# EAGLE design wt12_breakout_board_v11 (EAGLE 5.11)
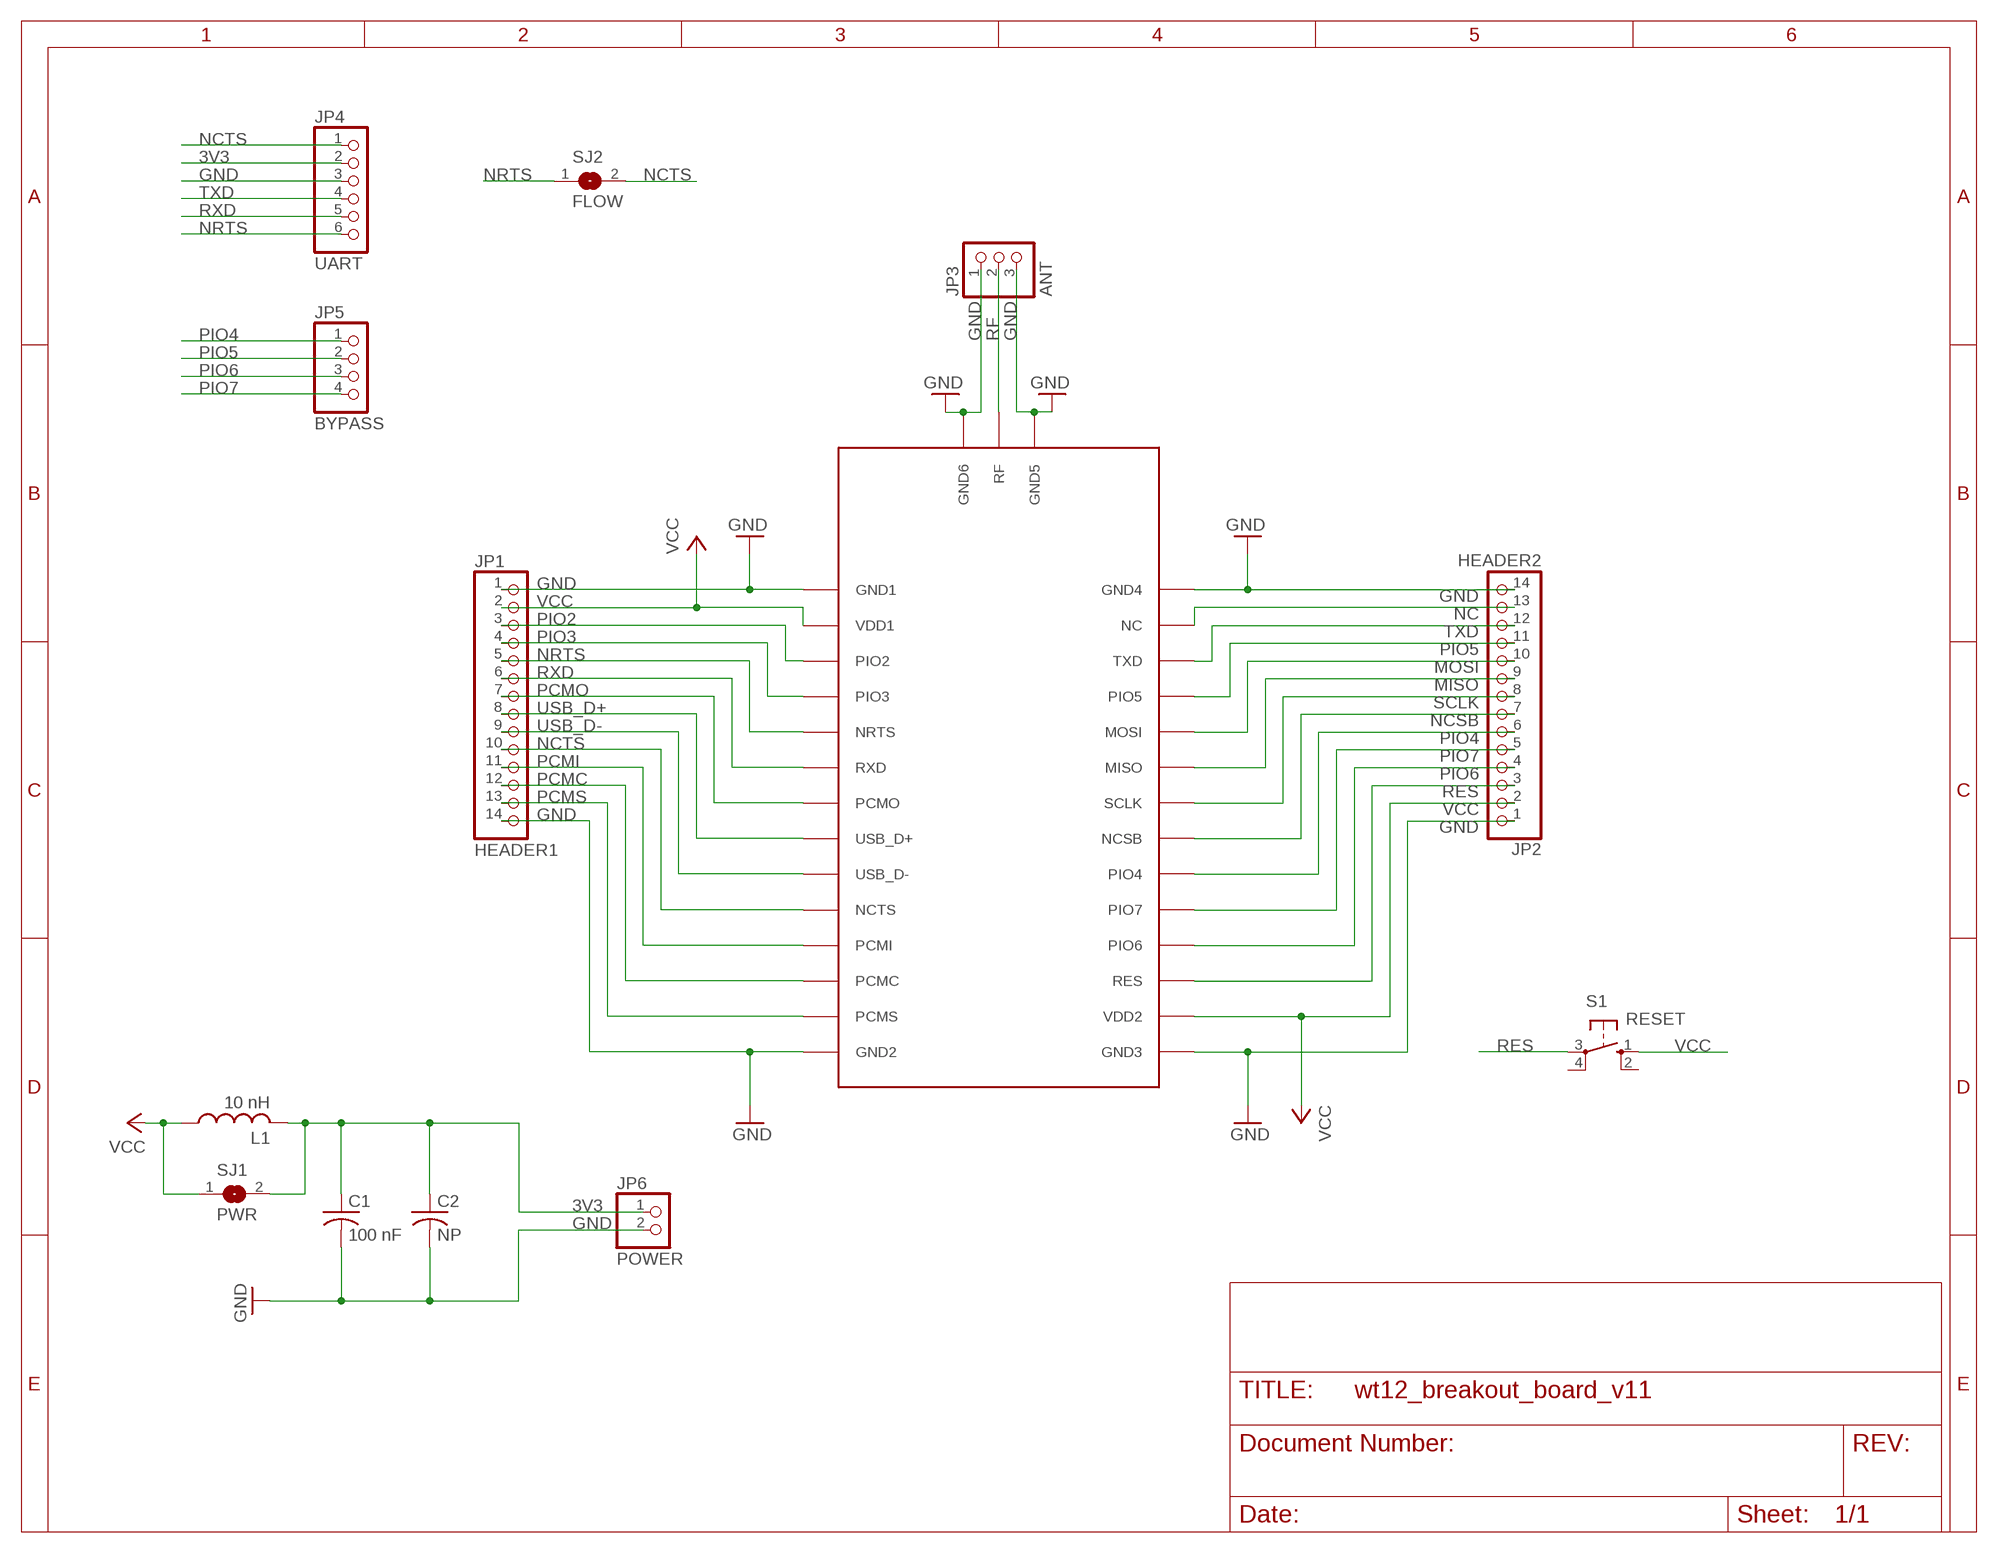
[diagram p0: schematic, sheet 1]

## Parts
C1  100 nF  C-US025-025X050  [C025-025X050]
C2  NP  C-US025-025X050  [C025-025X050]
JP1  HEADER1  PINHD-1X14  [1X14]
JP2  HEADER2  PINHD-1X14  [1X14]
JP3  ANT  PINHD-1X3  [1X03]
JP4  UART  PINHD-1X6  [1X06]
JP5  BYPASS  PINHD-1X4  [1X04]
JP6  POWER  PINHD-1X2  [1X02]
L1  10 nH  L-US0204/7  [0204/7]
S1  RESET  10-XX  [B3F-10XX]
SJ1  PWR  SJ  [SJ]
SJ2  FLOW  SJ  [SJ]
U1  WT12  [WT12]

## Nets
3V3: C1.1 C2.1 JP4.2 JP6.1 L1.2 SJ1.2
GND: C1.2 C2.2 JP1.1 JP1.14 JP2.1 JP2.14 JP3.1 JP3.3 JP4.3 JP6.2 U1.GND1 U1.GND2 U1.GND3 U1.GND4 U1.GND5 U1.GND6
MISO: JP2.9 U1.MISO
MOSI: JP2.10 U1.MOSI
NC: JP2.13 U1.NC
NCSB: JP2.7 U1.NCSB
NCTS: JP1.10 JP4.1 SJ2.2 U1.NCTS
NRTS: JP1.5 JP4.6 SJ2.1 U1.NRTS
PCMC: JP1.12 U1.PCMC
PCMI: JP1.11 U1.PCMI
PCMO: JP1.7 U1.PCMO
PCMS: JP1.13 U1.PCMS
PIO2: JP1.3 U1.PIO2
PIO3: JP1.4 U1.PIO3
PIO4: JP2.6 JP5.1 U1.PIO4
PIO5: JP2.11 JP5.2 U1.PIO5
PIO6: JP2.4 JP5.3 U1.PIO6
PIO7: JP2.5 JP5.4 U1.PIO7
RES: JP2.3 S1.3(P) U1.RES
RF: JP3.2 U1.RF
RXD: JP1.6 JP4.5 U1.RXD
SCLK: JP2.8 U1.SCLK
TXD: JP2.12 JP4.4 U1.TXD
USB_D+: JP1.8 U1.USB_D+
USB_D-: JP1.9 U1.USB_D-
VCC: JP1.2 JP2.2 L1.1 S1.1(S) SJ1.1 U1.VDD1 U1.VDD2
Unconnected: S1.2(S1) S1.4(P1)

## Library data of the parts
C1 C2 = resistor:C-US: CAPACITOR, American symbol
JP1 JP2 = pinhead:PINHD-1X14: PIN HEADER
JP3 = pinhead:PINHD-1X3: PIN HEADER
JP4 = pinhead:PINHD-1X6: PIN HEADER
JP5 = pinhead:PINHD-1X4: PIN HEADER
JP6 = pinhead:PINHD-1X2: PIN HEADER
L1 = resistor:L-US: INDUCTOR, American symbol
S1 = switch-omron:10-XX: OMRON SWITCH; MPN: B3F-1000; OC_FARNELL: 176432; OC_NEWARK: 36M3542
SJ1 SJ2 = jumper:SJ: SMD solder JUMPER
U1 = wt12:WT12: WT12 is a class 2, Bluetooth 2.1 + EDR module. It's a highly integrated Bluetooth module, containing all the necessary elements from Bluetooth radio to antenna, and a fully implemented iWRAP protocol stack. Key Features: - Bluetooth class 2 - Integrated chip antenna - Enhanced Data Rates (EDR) with data throughput up to 2-3Mbps - Support for Adaptive Frequency Hopping (AFH) and 802.11 co-existence - USB version 2.0, UART with bypass mode, GPIO and PCM interfaces - 8MB flash memory - Size: 26 x 14 x 2,4mm - Simple iWRAP firmware for controlling Bluetooth wireless technology - Industrial temperature range from -40C to +85C - Based on CSR BC04 chipset - RoHS compliant - Up to 14 supported Bluetooth profiles in iWRAP firmware - Support for on-board applications - Fully qualified end product with Bluetooth 2.1 + EDR, CE, FCC and IC Bluegiga WT12 provides an ideal solution for developers that want to integrate Bluetooth wireless technology to their design with limited knowledge of Bluetooth and RF technologies. By using WT12 combined with Bluegiga's complete development, testing and verification service offering, and excellent developer support, OEMs and designers ensure that their products reach the market rapidly and cost-effectively in relation to time and resources. Bluegiga has in-house knowledge of both software and hardware - offering customers a single point of contact for all Bluetooth related issues.

## Net classes
0 default: width 0.254 mm, drill 0.508 mm, clearance 0.254 mm

## Board
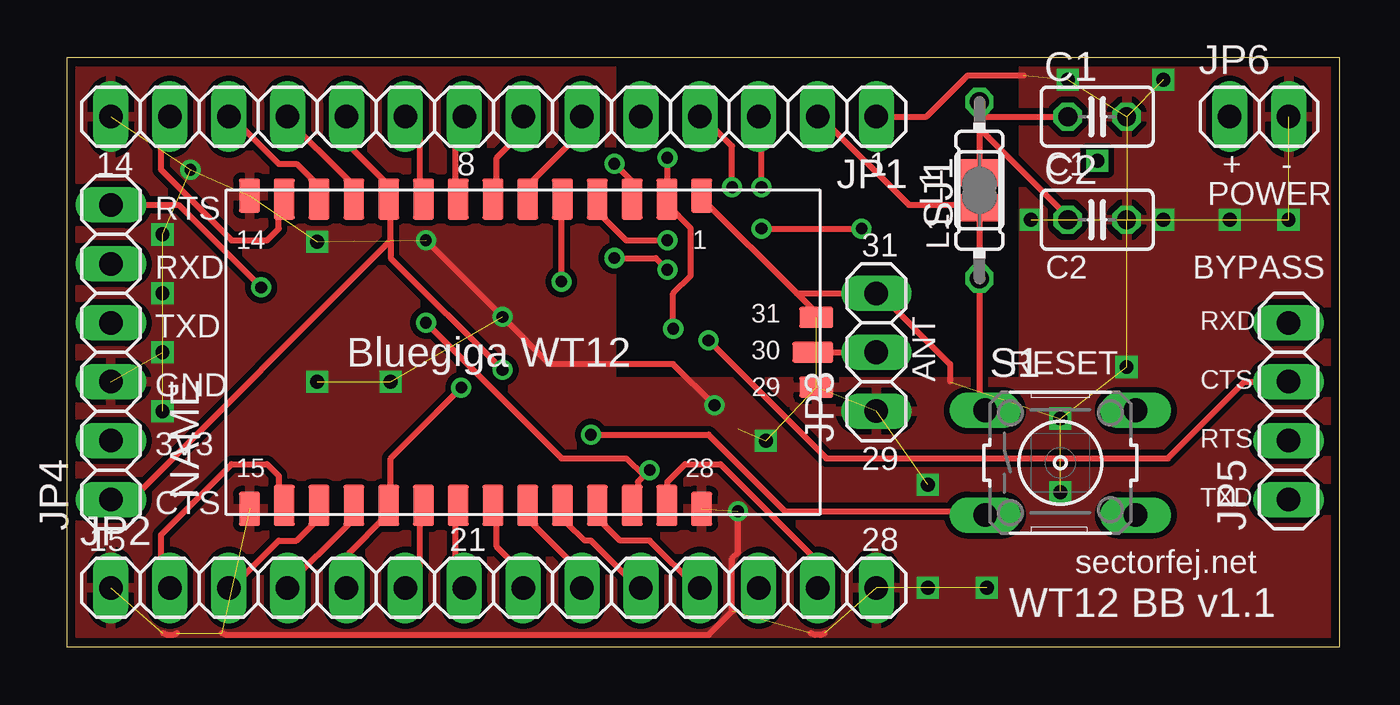
[diagram p1: board, top side]
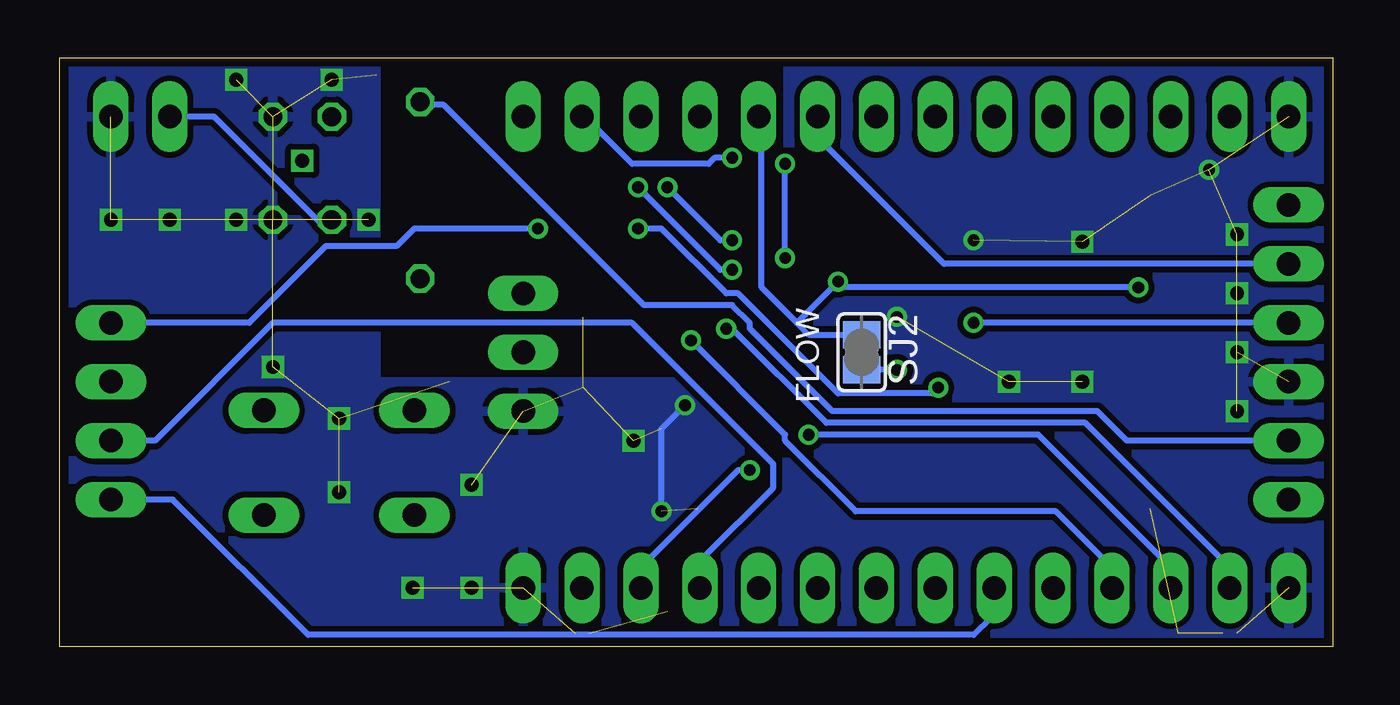
[diagram p2: board, bottom side, seen from below]

Size 54.91 x 25.39 mm. Coordinates in mm from the lower left corner, seen from the top.
Outline: 0,0 54.91,0 54.91,25.39 0,25.39 0,0
Copper layers (1*16): Top 0.0356mm / dielectric 1.5011mm / Bottom 0.0356mm
Design rules "LaenPCBOrder": minimum track width 6mil, minimum drill 13mil, track to track 6mil, track to pad 6mil, pad to pad 6mil, via to via 6mil, smd to smd 6mil, copper to edge 15mil, drill to drill 6mil, minimum pad ring 7mil, minimum via ring 7mil, stop-mask expansion 4mil, vias tented up to drill 0mil, thermal gap 10mil

### Footprints (pad centres in the part's own frame; a part is rotated, then mirrored left to right if it is on the bottom)
C025-025X050 = drill 0.813 octagon: 1 -1.27,0; 2 1.27,0
1X14 = drill 1.016 long: 1 -16.51,0; 2 -13.97,0; 3 -11.43,0; 4 -8.89,0; 5 -6.35,0; 6 -3.81,0; 7 -1.27,0; 8 1.27,0; 9 3.81,0; 10 6.35,0; 11 8.89,0; 12 11.43,0; 13 13.97,0; 14 16.51,0
1X03 = drill 1.016 long: 1 -2.54,0; 2 0,0; 3 2.54,0
1X06 = drill 1.016 long: 1 -6.35,0; 2 -3.81,0; 3 -1.27,0; 4 1.27,0; 5 3.81,0; 6 6.35,0
1X04 = drill 1.016 long: 1 -3.81,0; 2 -1.27,0; 3 1.27,0; 4 3.81,0
1X02 = drill 1.016 long: 1 -1.27,0; 2 1.27,0
0204/7 = drill 0.813 octagon: 1 -3.81,0; 2 3.81,0
B3F-10XX = drill 1.016 long: 1 -3.251,2.261; 2 3.251,2.261; 3 -3.251,-2.261; 4 3.251,-2.261
SJ = smd 1.168 x 1.6: 1 -0.762,0; 2 0.762,0
WT12 = smd 0.914 x 1.478: GND1 7.7,6.75; GND2 -11.8,6.75; GND3 -11.8,-6.75; GND4 7.7,-6.75 | smd 1.478 x 0.914: GND5 12.65,-1.5; GND6 12.65,1.5 | smd 0.914 x 1.778: MISO 0.2,-6.6; MOSI 1.7,-6.6; NC 6.2,-6.6; NCSB -2.8,-6.6; NCTS -5.8,6.6; NRTS 1.7,6.6; PCMC -8.8,6.6; PCMI -7.3,6.6; PCMO -1.3,6.6; PCMS -10.3,6.6; PIO2 4.7,6.6; PIO3 3.2,6.6; PIO4 -4.3,-6.6; PIO5 3.2,-6.6; PIO6 -7.3,-6.6; PIO7 -5.8,-6.6; RES -8.8,-6.6; RXD 0.2,6.6; SCLK -1.3,-6.6; TXD 4.7,-6.6; USB_D+ -2.8,6.6; USB_D- -4.3,6.6; VDD1 6.2,6.6; VDD2 -10.3,-6.6 | smd 1.778 x 0.914: RF 12.5,0

### Placement (x,y rotation side)
C1  44.45,22.86 0 top
C2  44.45,18.41 0 top
JP1  18.41,22.86 180 top
JP2  18.41,2.54 0 top
JP3  34.92,12.7 90 top
JP4  1.91,12.7 90 top
JP5  52.7,10.16 90 top
JP6  51.44,22.86 0 top
L1  39.37,19.68 90 top
S1  42.86,7.94 0 top
SJ1  39.37,19.68 90 top
SJ2  20.32,12.7 270 bottom
U1  19.68,12.7 0 top

### Tracks (layer width: path | path; a pad name or v marks a point on that pad's centre or on a via)
3V3
  Top 0.254: 39.37,22.86 39.37,22.35 | 39.37,22.35 SJ1.2 | L1.2 39.37,22.86 | 39.37,22.35 43.18,18.54 C2.1 | 39.37,22.86 C1.1
  Bottom 0.254: JP4.2 8.89,8.89 10.16,10.16 21.59,10.16 25.15,13.72 25.15,13.97 25.91,14.73 29.72,14.73 38.35,23.37 39.37,23.37 L1.2 | JP6.1 48.26,22.86 43.69,18.29 43.18,18.29 C2.1
GND  (via drill 0.51, 0.6)  (37 unrouted)
  Top 0.254: JP1.1 37.08,22.86 38.86,24.64 41.27,24.64 | 31.5,15.24 32.51,14.22 U1.GND6 | 31.5,15.24 27.43,19.3 U1.GND1 | 31.5,15.24 JP3.3 35.05,15.24 38.1,12.19 38.1,11.43 | 4.75,0.58 4.57,0.51 4.32,0.51 4.14,0.58 | v28.96,5.84 28.96,4.06 28.7,3.81 28.7,1.52 27.69,0.51 6.86,0.51 6.68,0.58 | v27.94,10.41 26.16,12.19 20.83,12.19 v18.8,14.22 v15.49,17.53 | 32.08,0.58 32.26,0.51 32.51,0.51 32.69,0.58
  Bottom 0.254: v28.96,5.84 28.96,9.4 v27.94,10.41
  other vias: 5.33,20.57 4.13,17.78 4.13,15.24 4.13,12.7 4.13,10.16 10.79,17.46 10.79,11.43 13.97,11.43 30.16,8.89 37.15,6.99 37.15,2.54 39.69,2.54 42.86,6.67 42.86,9.84 45.72,12.06 41.59,18.41 47.31,18.41 50.16,18.41 52.7,18.41 47.31,24.45 43.18,24.45
  pour Bottom: 0,25.4 23.5,25.4 23.5,11.43 41.27,11.43 41.27,25.4 54.93,25.4 54.93,0 0,0
  pour Top: 0,25.4 23.5,25.4 23.5,11.43 41.27,11.43 41.27,25.4 54.93,25.4 54.93,0 0,0
MISO
  Top 0.254: U1.MISO 20.07,6.1 20.07,5.33 22.1,3.3 22.1,2.54 JP2.9
MOSI
  Top 0.254: U1.MOSI 21.59,6.1 21.59,5.33 22.35,4.57 22.61,4.57 24.64,2.54 JP2.10
N$21  (via drill 0.6)
  other vias: 44.45,20.95
NC
  Top 0.254: U1.NC 25.91,6.35 25.91,7.11 26.67,7.87 28.19,7.87 32.26,3.81 32.26,2.54 JP2.13
NCSB
  Top 0.254: U1.NCSB 16.76,6.1 16.76,2.79 17.02,2.54 JP2.7
NCTS  (via drill 0.51)
  Top 0.254: v18.8,11.94 13.97,16.76 13.97,17.53 | 13.97,17.53 13.97,19.05 U1.NCTS 13.72,19.3 13.72,20.07 12.19,21.59 12.19,22.86 JP1.10 | 13.97,17.53 2.79,6.35 JP4.1
  Bottom 0.254: v18.8,11.94 SJ2.2
NRTS  (via drill 0.51)
  Top 0.254: v21.34,15.75 21.34,19.05 U1.NRTS | v8.38,15.49 4.83,19.05 JP4.6
  Bottom 0.254: SJ2.1 22.61,13.46 23.11,13.97 | 23.11,13.97 24.64,15.49 24.64,22.86 JP1.5 | 21.59,15.49 23.11,13.97 | v8.38,15.49 21.59,15.49 | 21.59,15.49 v21.34,15.75
PCMC
  Top 0.254: U1.PCMC 10.67,19.3 10.67,20.07 9.91,20.83 9.14,20.83 7.11,22.86 JP1.12
PCMI
  Top 0.254: U1.PCMI 12.19,19.3 12.19,20.07 9.4,22.86 JP1.11
PCMO
  Top 0.254: U1.PCMO 18.54,19.3 18.54,21.08 19.56,22.1 19.56,22.86 JP1.7
PCMS
  Top 0.254: U1.PCMS 9.14,19.05 9.14,18.03 8.64,17.53 7.11,17.53 4.06,20.57 4.06,22.61 4.32,22.86 JP1.13
PIO2  (via drill 0.51)
  Top 0.254: v23.62,20.83 24.38,20.07 U1.PIO2 | v23.62,16.76 25.4,16.76 v25.91,16.26 | v29.97,19.81 29.97,22.86 JP1.3
  Bottom 0.254: v23.62,16.76 v23.62,20.83 | v25.91,16.26 26.42,16.26 v29.97,19.81
PIO3  (via drill 0.51)
  Top 0.254: v25.91,17.53 24.13,17.53 23.11,18.54 23.11,19.05 U1.PIO3 | v28.7,19.81 28.7,21.59 27.43,22.86 JP1.4
  Bottom 0.254: v25.91,17.53 26.42,17.53 v28.7,19.81
PIO4
  Top 0.254: U1.PIO4 15.24,6.1 15.24,3.3 14.48,2.54 JP2.6
  Bottom 0.254: JP5.1 50.04,6.35 44.2,0.51 15.49,0.51 14.73,1.27 14.73,2.54 JP2.6
PIO5
  Top 0.254: U1.PIO5 23.11,6.1 23.11,5.33 23.88,4.57 25.15,4.57 27.18,2.54 JP2.11
  Bottom 0.254: JP5.2 50.8,8.89 45.72,13.97 30.23,13.97 24.13,7.87 24.13,6.86 27.18,3.81 27.18,2.54 JP2.11
PIO6  (via drill 0.51)
  Top 0.254: U1.PIO6 12.19,6.1 12.19,5.33 9.4,2.54 JP2.4 | v27.69,13.21 32.77,8.13 47.5,8.13 50.8,11.43 JP5.3
  Bottom 0.254: v27.69,13.21 23.62,9.14 23.62,8.89 20.57,5.84 11.94,5.84 9.65,3.56 9.65,2.54 JP2.4
PIO7  (via drill 0.51)
  Top 0.254: JP2.5 12.19,2.54 12.19,4.06 13.72,5.59 13.72,6.1 U1.PIO7 13.97,6.35 13.97,8.13 v17.02,11.18 | v29.97,18.03 v34.29,18.03
  Bottom 0.254: v34.29,18.03 39.62,18.03 40.39,17.27 43.43,17.27 46.74,13.97 JP5.4 | v29.97,18.03 28.96,18.03 26.16,15.24 25.65,15.24 21.34,10.92 17.27,10.92 v17.02,11.18
RES  (via drill 0.51)
  Top 0.254: U1.RES 10.67,6.1 10.67,5.33 9.91,4.57 9.14,4.57 7.11,2.54 JP2.3 | v22.61,9.14 27.69,9.14 30.99,5.84 39.37,5.84 S1.3
  Bottom 0.254: v22.61,9.14 12.7,9.14 7.11,3.56 7.11,2.54 JP2.3
RF
  Top 0.254: U1.RF JP3.2
RXD
  Top 0.254: U1.RXD 20.07,19.3 20.07,20.07 22.1,22.1 22.1,22.86 JP1.6
  Bottom 0.254: JP4.5 16.76,16.51 22.1,21.84 22.1,22.86 JP1.6
SCLK
  Top 0.254: U1.SCLK 18.54,6.1 18.54,4.32 19.56,3.3 19.56,2.54 JP2.8
TXD  (via drill 0.51)
  Top 0.254: 24.89,7.37 24.64,7.11 24.64,6.35 U1.TXD | v15.49,13.97 21.34,8.13 24.13,8.13 24.89,7.37 | 24.89,7.37 v25.15,7.62
  Bottom 0.254: v25.15,7.62 25.65,7.62 29.72,3.56 29.72,2.54 JP2.12 | JP4.4 v15.49,13.97
USB_D+
  Top 0.254: U1.USB_D+ 16.76,19.3 16.76,22.61 17.02,22.86 JP1.8
USB_D-
  Top 0.254: U1.USB_D- 15.24,19.3 15.24,22.1 14.48,22.86 JP1.9
VCC  (via drill 0.51)
  Top 0.254: S1.1 39.37,10.41 L1.1 SJ1.1 39.37,19.05 36.32,19.05 32.51,22.86 JP1.2 | U1.VDD2 9.14,6.35 9.14,7.37 8.64,7.87 7.11,7.87 4.06,4.83 4.06,2.79 4.32,2.54 JP2.2 | v25.91,21.08 25.91,19.3 U1.VDD1 25.91,19.05 26.92,18.03 26.92,16 26.16,15.24 v26.16,13.72
  Bottom 0.254: v25.91,21.08 26.67,21.08 26.92,20.83 30.23,20.83 32.26,22.86 JP1.2 | v26.16,13.72 25.91,13.72 21.84,9.65 10.67,9.65 4.57,3.56 4.57,2.54 JP2.2

### Text on the board
tPlace: 14 | 8 | 1 | C1 | + | - | L1 | POWER | RTS | 14 | 1 | 31 | RXD | C2 | BYPASS | 31 | RXD | TXD | Bluegiga WT12 | 30 | RESET | GND | 29 | ANT | CTS | RTS | 3V3 | 29 | 15 | 28 | CTS | TXD | 15 | 21 | 28 | sectorfej.net | WT12 BB v1.1
bPlace: FLOW